# Altium schematic sheet LAN.SchDoc
size A; SheetNumber: 6; SheetTotal: 10
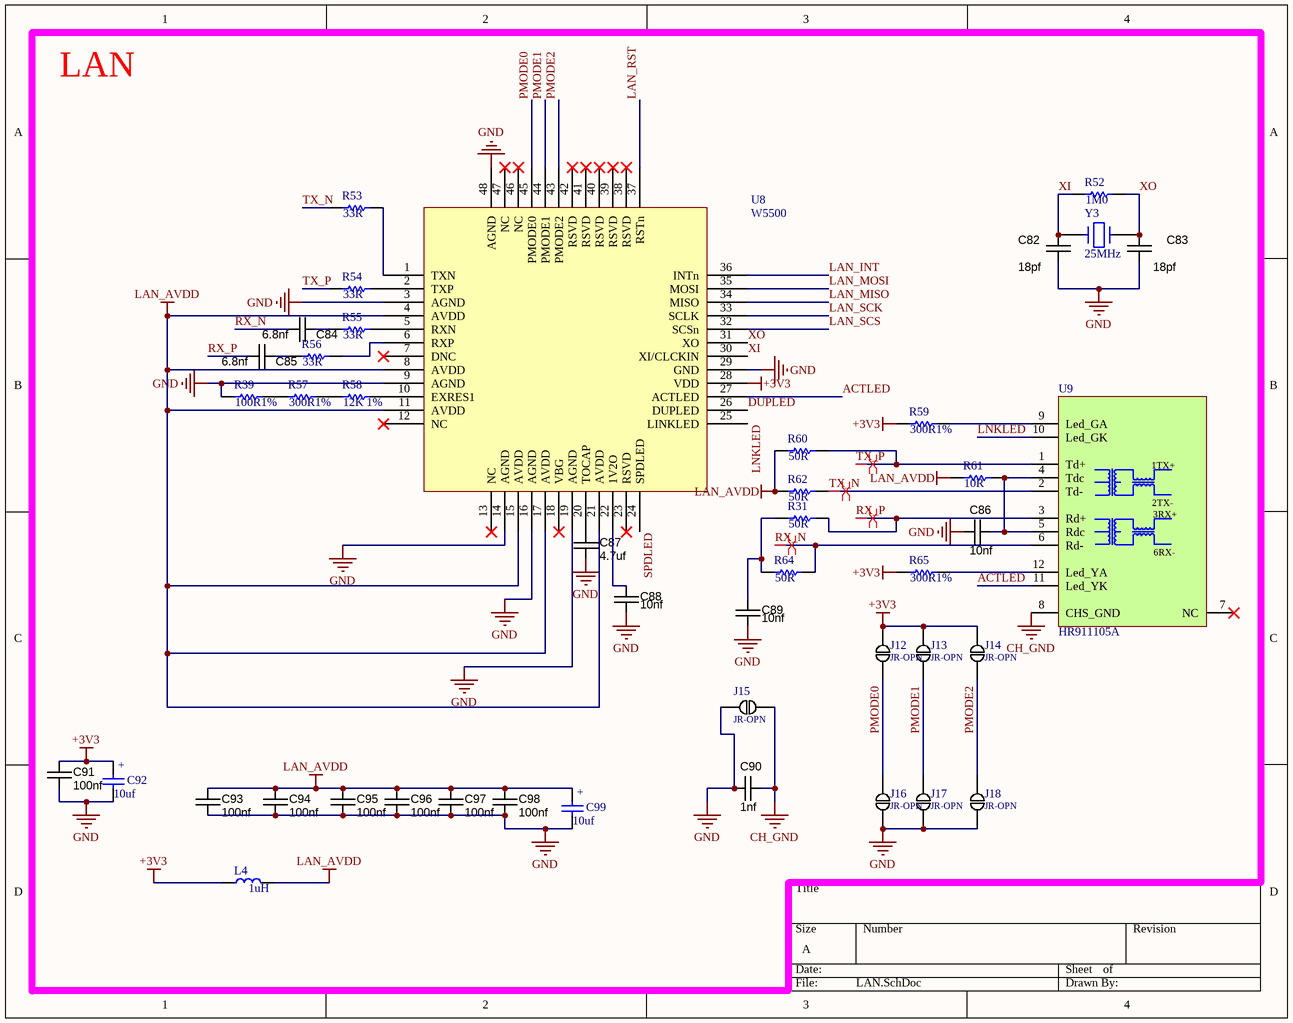
[diagram p0: LAN.SchDoc]

## Parts
C82  18pf  [CAPC1608X90N]
C83  18pf  [CAPC1608X90N]
C84  6.8nf  [CAPC1608X90N]
C85  6.8nf  [CAPC1608X90N]
C86  10nf  [CAPC1608X90N]
C87  4.7uf  [CAPC1608X90N]
C88  10nf  [CAPC1608X90N]
C89  10nf  [CAPC1608X90N]
C90  1nf  [CAPC1608X90N]
C91  100nf  [CAPC1608X90N]
C92  10uf  [MY_CAP_SMD-A]
C93  100nf  [CAPC1608X90N]
C94  100nf  [CAPC1608X90N]
C95  100nf  [CAPC1608X90N]
C96  100nf  [CAPC1608X90N]
C97  100nf  [CAPC1608X90N]
C98  100nf  [CAPC1608X90N]
C99  10uf  [MY_CAP_SMD-A]
J12  JR-OPN  [0603-J]
J13  JR-OPN  [0603-J]
J14  JR-OPN  [0603-J]
J15  JR-OPN  [0603-J]
J16  JR-OPN  [0603-J]
J17  JR-OPN  [0603-J]
J18  JR-OPN  [0603-J]
L4  1uH  [L0805]
R31  50R  [Resistor_SMD_0603 (1608)]
R39  100R1%  [Resistor_SMD_0603 (1608)]
R52  1M0  [Resistor_SMD_0603 (1608)]
R53  33R  [Resistor_SMD_0603 (1608)]
R54  33R  [Resistor_SMD_0603 (1608)]
R55  33R  [Resistor_SMD_0603 (1608)]
R56  33R  [Resistor_SMD_0603 (1608)]
R57  300R1%  [Resistor_SMD_0603 (1608)]
R58  12K 1%  [Resistor_SMD_0603 (1608)]
R59  300R1%  [Resistor_SMD_0603 (1608)]
R60  50R  [Resistor_SMD_0603 (1608)]
R61  10R  [Resistor_SMD_0603 (1608)]
R62  50R  [Resistor_SMD_0603 (1608)]
R64  50R  [Resistor_SMD_0603 (1608)]
R65  300R1%  [Resistor_SMD_0603 (1608)]
U8  W5500  [LQFP48]
U9  HR911105A  [HR911105A]
Y3  25MHz  [My_Crystal - SMD]

## Nets
+3V3: C91.2 C92.+ J12.1 J13.1 J14.1 L4.1 R59.1 R65.1 U8.28(VDD)
CH_GND: C90.2 J15.1 U9.8(CHS_GND)
GND: C82.1 C83.1 C86.1 C87.1 C88.1 C89.1 C90.1 C91.1 C92.- C93.1 C94.1 C95.1 C96.1 C97.1 C98.1 C99.- J15.2 J16.2 J17.2 J18.2 R39.1 U8.3(AGND) U8.9(AGND) U8.14(AGND) U8.16(AGND) U8.19(AGND) U8.29(GND) U8.48(AGND)
LAN_AVDD: C93.2 C94.2 C95.2 C96.2 C97.2 C98.2 C99.+ L4.2 R60.1 R61.1 R62.1 U8.4(AVDD) U8.8(AVDD) U8.11(AVDD) U8.15(AVDD) U8.17(AVDD) U8.21(AVDD)
ACTLED: U8.27(ACTLED) U9.11(Led_YK)
DUPLED: U8.26(DUPLED)
LAN_INT: U8.36(INTn)
LAN_MISO: U8.34(MISO)
LAN_MOSI: U8.35(MOSI)
LAN_RST: U8.37(RSTn)
LAN_SCK: U8.33(SCLK)
LAN_SCS: U8.32(SCSn)
LNKLED: U8.25(LINKLED) U9.10(Led_GK)
PMODE0: J12.2 J16.1 U8.45(PMODE0)
PMODE1: J13.2 J17.1 U8.44(PMODE1)
PMODE2: J14.2 J18.1 U8.43(PMODE2)
RX_N: C84.2 R64.2 U9.6(Rd-)
RX_P: C85.2 R31.2 U9.3(Rd+)
SPDLED: U8.24(SPDLED)
TX_N: R53.1 R62.2 U9.2(Td-)
TX_P: R54.1 R60.2 U9.1(Td+)
XI: C82.2 R52.1 U8.30(XI/CLCKIN) Y3.1
XO: C83.2 R52.2 U8.31(XO) Y3.2
NetC84_1: C84.1 R55.1
NetC85_1: C85.1 R56.1
NetC86_2: C86.2 R61.2 U9.4(Tdc) U9.5(Rdc)
NetC87_2: C87.2 U8.20(TOCAP)
NetC88_2: C88.2 U8.22(1V2O)
NetC89_2: C89.2 R31.1 R64.1
NetR39_2: R39.2 R57.1
NetR53_2: R53.2 U8.1(TXN)
NetR54_2: R54.2 U8.2(TXP)
NetR55_2: R55.2 U8.5(RXN)
NetR56_2: R56.2 U8.6(RXP)
NetR57_2: R57.2 R58.1
NetR58_2: R58.2 U8.10(EXRES1)
NetR59_2: R59.2 U9.9(Led_GA)
NetR65_2: R65.2 U9.12(Led_YA)

Not connected (* = marked no-connect by the designer): U8 7(DNC)* 12(NC)* 13(NC)* 18(VBG)* 23(RSVD)* 38(RSVD)* 39(RSVD)* 40(RSVD)* 41(RSVD)* 42(RSVD)* 46(NC)* 47(NC)*; U9 7(NC)*

## Layout directives
differential pair: RX_N, RX_P, TX_N, TX_P

## Notes on the sheet
- LAN
- (in symbol HR911105A) 1TX+; 2TX-; 3RX+ /; 6RX- /

## Library data of the parts
C82-C91 C93-C98 = CAPC_100n_0603_X7R_50V_10%: Capacitor SMD Cer 100nF 10% 50V X7R 0603; Manufacturer 1: AVX Corporation; Manufacturer Part Number 1: 06035C104KAT2A; Ratings: 50V; X7R; Material: ceramic; SCDType: spec; Value: 100n; Manufacturer 2: TDK Corporation; Manufacturer Part Number 2: C1608X7R1H104K; Package / Case: 0603 (1608 Metric); Tolerance: ±10%; Supplier 1: Digi-Key; Supplier Part Number 1: 478-5052-1-ND; ComponentLink1URL: http://www.avx.com/docs/Catalogs/cx7r.pdf; ComponentLink1Description: http://www.avx.com/docs/Catalogs/cx7r.pdf; Supplier 2: Digi-Key; Supplier Part Number 2: 445-1314-1-ND; ComponentLink2URL: http://product.tdk.com/capacitor/mlcc/en/documents/mlcc_commercial_general_en.pdf; ComponentLink2Description: http://product.tdk.com/capacitor/mlcc/en/documents/mlcc_commercial_general_en.pdf
C92 C99 = CAP_TANTAL_A: 3.2X1.6MM; Value: 3300u
J12-J18 = BYPASS: SOLDERDOT BYPASS; Manufacturer Part Number 1: Board Feature; Reel: Open; Supplier 1: Solder-it-yourself; Manufacturer 1: Board feature
L4 = Inductor SMD NC 0805: DatasheetVersion: 2022; ComponentLink1Description: Tarahiboard; ComponentLink1URL: https://www.tarahiboard.com/product/library-pack; Value: 1uH
R31 R39 R52-R62 R64 R65 = Resistor: Resistor 0603; Email: razi.vesali@gmail.com; Value: 10k; Published: 17-Jun-2016; LatestRevisionNote: Re-released for puplic; Publisher: Seyed Razi Vesali
U8 = W5500: Ethernet Controller, 10/100, SPI, DMA
U9 = HR911105A: RJ45, 10/100BASE, G/Y LED
Y3 = CRYSTAL_SMD: Crystal